# Altium schematic sheet STM32.SchDoc
size B; DocumentNumber: 3; SheetNumber: 2; SheetTotal: 4
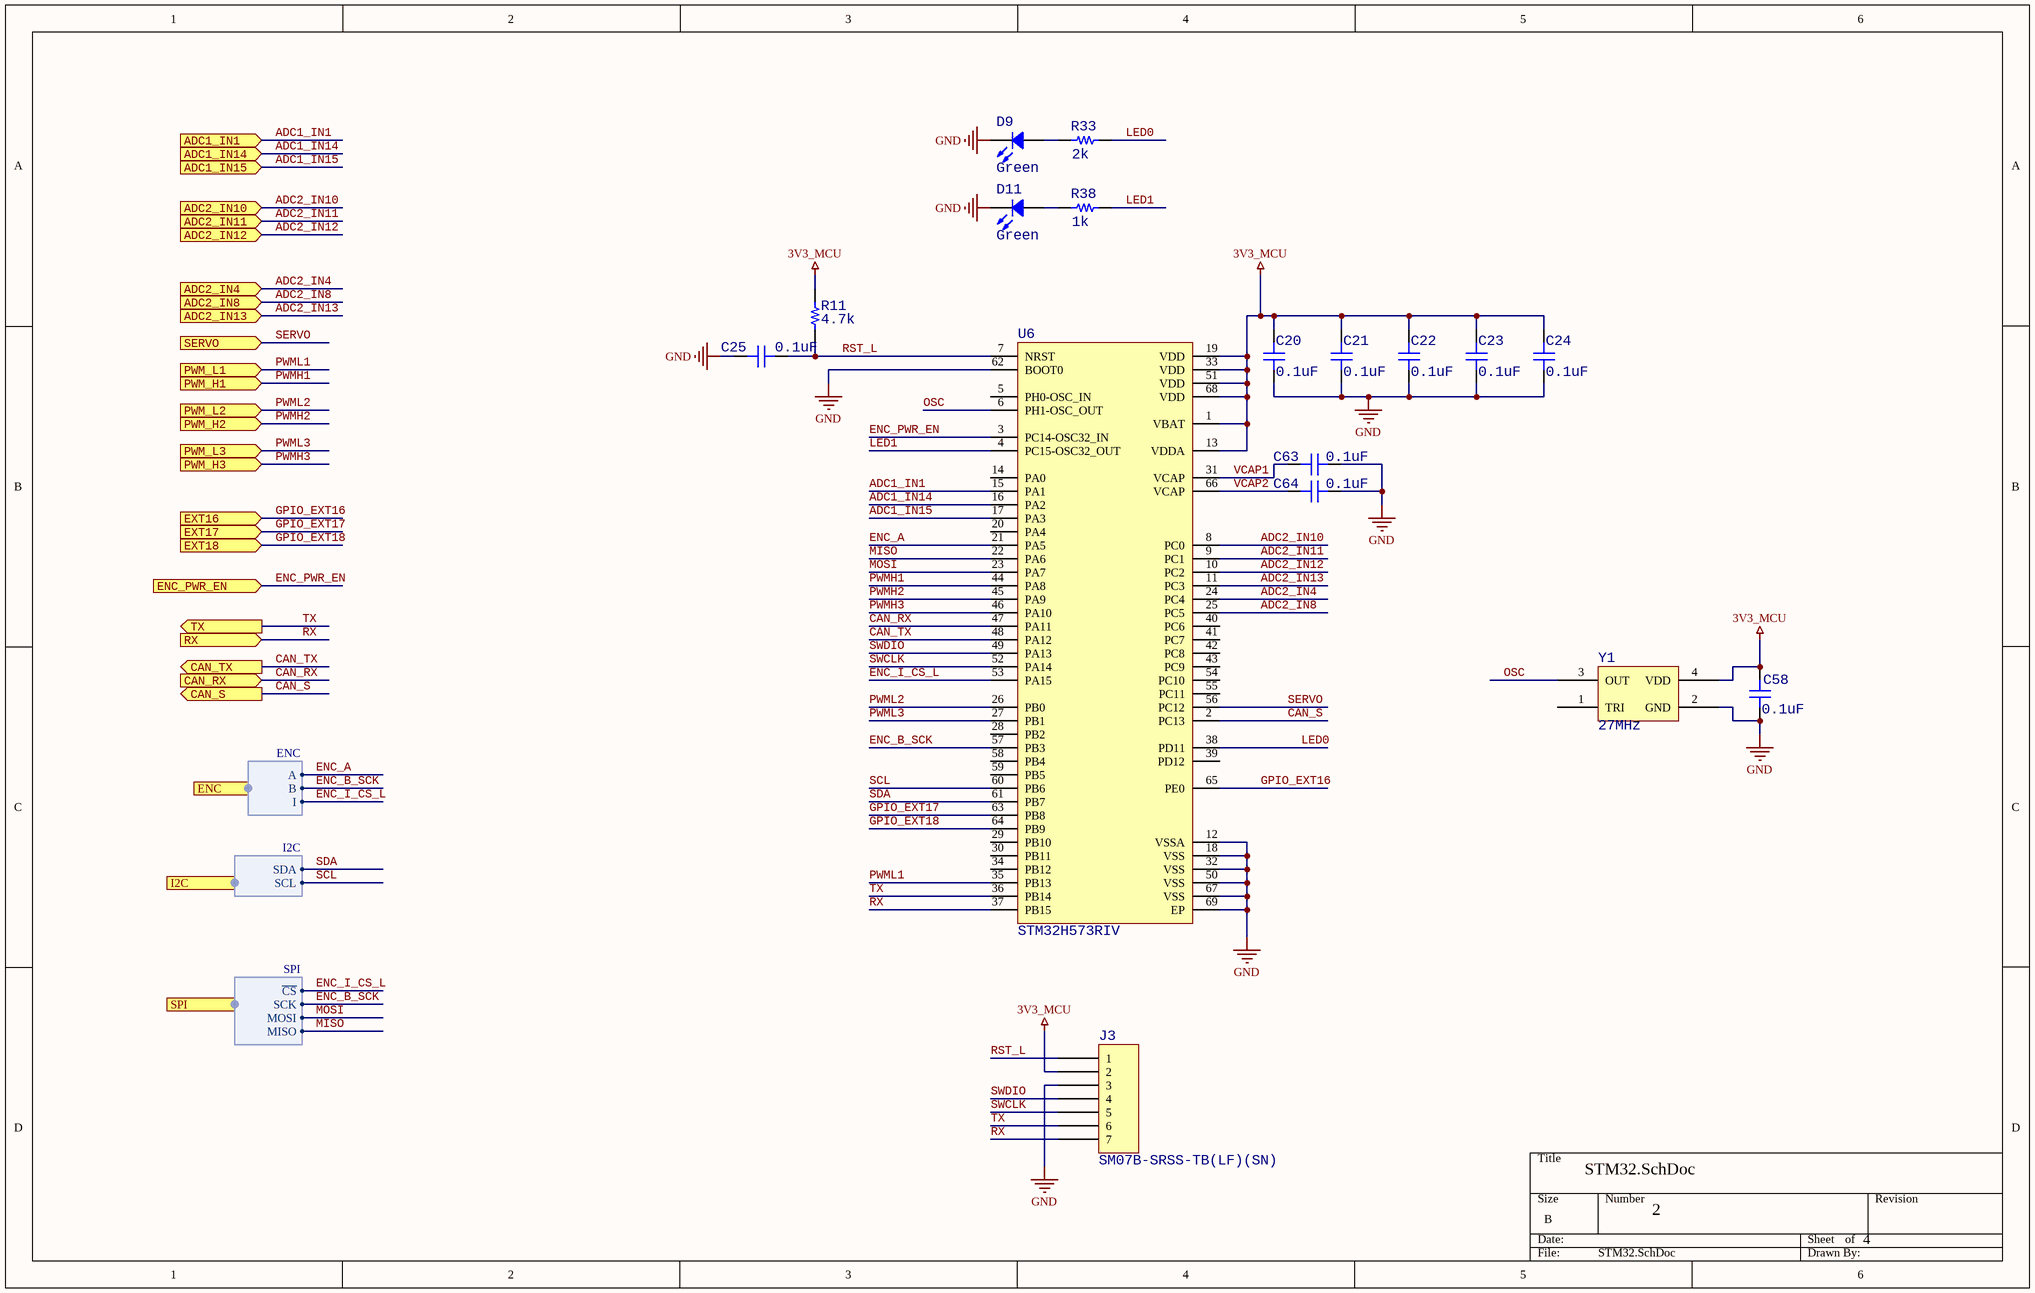
[diagram p0: STM32.SchDoc]

## Parts
C20  0.1uF  [CAP_0402]
C21  0.1uF  [CAP_0402]
C22  0.1uF  [CAP_0402]
C23  0.1uF  [CAP_0402]
C24  0.1uF  [CAP_0402]
C25  0.1uF  [CAP_0402]
C58  0.1uF  [CAP_0402]
C63  0.1uF  [CAP_0402]
C64  0.1uF  [CAP_0402]
D9  Green  [LED 0603_1608 GREEN]
D11  Green  [LED 0603_1608 GREEN]
J3  SM07B-SRSS-TB(LF)(SN)  [JST SM07B-SRSS-TB]
R11  4.7k  [RES_0402]
R33  2k  [RES_0402]
R38  1k  [RES_0402]
U6  STM32H573RIV  [68-VFQFPN]
Y1  27MHz  [ABRACON ASD]

## Ports
ADC1_IN1 (in), ADC1_IN14 (in), ADC1_IN15 (in), ADC2_IN4 (in), ADC2_IN8 (in), ADC2_IN10 (in), ADC2_IN11 (in), ADC2_IN12 (in), ADC2_IN13 (in), CAN_RX (in), CAN_S (out), CAN_TX (out), ENC (harness ENC), ENC_PWR_EN (in), EXT16 (in), EXT17 (in), EXT18 (in), I2C (harness I2C), PWM_H1 (in), PWM_H2 (in), PWM_H3 (in), PWM_L1 (in), PWM_L2 (in), PWM_L3 (in), RX (in), SERVO (in), SPI (harness SPI), TX (out)

## Harnesses
I2C: SDA, SCL
ENC: A, B, I
SPI: ~{CS}, SCK, MOSI, MISO

## Nets
3V3_MCU: C20.2 C21.2 C22.2 C23.2 C24.2 C58.2 J3.2 R11.2 U6.1(VBAT) U6.13(VDDA) U6.19(VDD) U6.33(VDD) U6.51(VDD) U6.68(VDD) Y1.4(VDD)
GND: C20.1 C21.1 C22.1 C23.1 C24.1 C25.2 C58.1 C63.1 C64.1 D9.2 D11.2 J3.3 U6.12(VSSA) U6.18(VSS) U6.32(VSS) U6.50(VSS) U6.62(BOOT0) U6.67(VSS) U6.69(EP) Y1.2(GND)
ADC1_IN1: U6.15(PA1) ; port ADC1_IN1
ADC1_IN14: U6.16(PA2) ; port ADC1_IN14
ADC1_IN15: U6.17(PA3) ; port ADC1_IN15
ADC2_IN4: U6.24(PC4) ; port ADC2_IN4
ADC2_IN8: U6.25(PC5) ; port ADC2_IN8
ADC2_IN10: U6.8(PC0) ; port ADC2_IN10
ADC2_IN11: U6.9(PC1) ; port ADC2_IN11
ADC2_IN12: U6.10(PC2) ; port ADC2_IN12
ADC2_IN13: U6.11(PC3) ; port ADC2_IN13
CAN_RX: U6.47(PA11) ; port CAN_RX
CAN_S: U6.2(PC13) ; port CAN_S
CAN_TX: U6.48(PA12) ; port CAN_TX
ENC_A: U6.21(PA5) ; port ENC.A
ENC_B_SCK: U6.57(PB3) ; port ENC.B, port SPI.SCK
ENC_I_CS_L: U6.53(PA15) ; port ENC.I, port SPI.~{CS}
ENC_PWR_EN: U6.3(PC14-OSC32_IN) ; port ENC_PWR_EN
GPIO_EXT16: U6.65(PE0) ; port EXT16
GPIO_EXT17: U6.63(PB8) ; port EXT17
GPIO_EXT18: U6.64(PB9) ; port EXT18
LED0: R33.2 U6.38(PD11)
LED1: R38.2 U6.4(PC15-OSC32_OUT)
MISO: U6.22(PA6) ; port SPI.MISO
MOSI: U6.23(PA7) ; port SPI.MOSI
OSC: U6.6(PH1-OSC_OUT) Y1.3(OUT)
PWMH1: U6.44(PA8) ; port PWM_H1
PWMH2: U6.45(PA9) ; port PWM_H2
PWMH3: U6.46(PA10) ; port PWM_H3
PWML1: U6.35(PB13) ; port PWM_L1
PWML2: U6.26(PB0) ; port PWM_L2
PWML3: U6.27(PB1) ; port PWM_L3
RST_L: C25.1 J3.1 R11.1 U6.7(NRST)
RX: J3.7 U6.37(PB15) ; port RX
SCL: U6.60(PB6) ; port I2C.SCL
SDA: U6.61(PB7) ; port I2C.SDA
SERVO: U6.56(PC12) ; port SERVO
SWCLK: J3.5 U6.52(PA14)
SWDIO: J3.4 U6.49(PA13)
TX: J3.6 U6.36(PB14) ; port TX
VCAP1: C63.2 U6.31(VCAP)
VCAP2: C64.2 U6.66(VCAP)
NetD9_1: D9.1 R33.1
NetD11_1: D11.1 R38.1

Not connected (* = marked no-connect by the designer): U6 5(PH0-OSC_IN) 14(PA0) 20(PA4) 28(PB2) 29(PB10) 30(PB11) 34(PB12) 39(PD12) 40(PC6) 41(PC7) 42(PC8) 43(PC9) 54(PC10) 55(PC11) 58(PB4) 59(PB5); Y1 1(TRI)

## Library data of the parts
C20-C25 C58 C63 C64 = CAP_0402: CAP CER 402; Value: 0.1uF
D9 D11 = XZCDGK53W-8VF: LED GREEN CLEAR 2SMD; Manufacturer: SunLED; Configuration: Independent; Current - Test: 2mA; Lens Color: Colorless; Lens Size: 0.35mm Dia; Lens Style: Round with Domed Top; Millicandela Rating: 417mcd; Viewing Angle: 60°; Voltage - Forward (Vf) (Typ): 2.65V; Wavelength - Dominant: 525nm; Wavelength - Peak: 515nm; Part Number: XZCDGK53W-8VF; Color: Green; ComponentLink1Description: Datasheet; ComponentLink1URL: https://www.sunledusa.com/products/spec/XZCDGK53W-8VF.pdf; ComponentLink2Description: DigiKey Link; ComponentLink2URL: https://www.digikey.com/en/products/detail/sunled/XZCDGK53W-8VF/10449775; Device Package: 0603 (1608 Metric); Height (Max): 1.10mm; LastUpdated: 6/3/2024 7:58:52 PM; Lens Transparency: Clear; Lifecycle Status: Active; Minimum Order: 1; Mounting Type: Surface Mount; Package / Case: 0603 (1608 Metric); Packaging: TapeAndReel; PartId: 938; Part Status: Active; Price: 0.15; Series: Ultra Low Current; Size / Dimension: 1.60mm L x 0.80mm W; Supplier 1: DigiKey; Supplier Part Number 1: 1497-XZCDGK53W-8VFCT-ND; Supplier Device Package: 2-SMD; Value: Green
J3 = SM07B-SRSS-TB(LF)(SN): CONN HEADER SMD R/A 7POS 1MM; Manufacturer: JST Sales America Inc.; Current Rating (Amps): 0.7A; Material Flammability Rating: UL94 V-0; Number of Positions: 7; Number of Positions Loaded: All; Pitch - Mating: 0.039" (1.00mm); Shrouding: Shrouded - 4 Wall; Style: Board to Cable/Wire; Voltage Rating: 50V; Part Number: SM07B-SRSS-TB(LF)(SN); ComponentLink1Description: Datasheet; ComponentLink1URL: http://www.jst-mfg.com/product/pdf/eng/eSH.pdf; ComponentLink2Description: DigiKey Link; ComponentLink2URL: http://digikey.com/product-detail/en/jst-sales-america-inc/SM07B-SRSS-TB-LF-SN/455-1807-1-ND/926878; Connector Type: Header; Contact Finish - Mating: Tin; Contact Finish - Post: Tin; Contact Material: Copper Alloy; Contact Shape: Square; Contact Type: Male Pin; Fastening Type: Push-Pull; Features: Solder Retention; Insulation Color: Natural; Insulation Height: 0.114" (2.90mm); Insulation Material: Polyamide (PA), Nylon; LastUpdated: 1/12/2020 11:42:26 PM; Lifecycle Status: Active; Minimum Order: 1; Mounting Type: Surface Mount, Right Angle; Number of Rows: 1; Operating Temperature: -25°C ~ 85°C; Packaging: TapeAndReel; PartId: 65; Part Status: Active; Price: 0.39; Series: SR; Supplier 1: DigiKey; Supplier Part Number 1: 455-1807-1-ND; Termination: Solder
R11 R33 R38 = RES_0402: RES 0402
Y1 = ASD3-27.000MHZ-EC-T: XTAL OSC XO 27.0000MHZ HCMOS SMD; Manufacturer: Abracon LLC; Base Resonator: Crystal; Current - Supply (Max): 4mA; Frequency Stability: ±50ppm; Function: Enable/Disable; Voltage - Supply: 1.8V; Part Number: ASD3-27.000MHZ-EC-T; ComponentLink1Description: Datasheet; ComponentLink1URL: https://abracon.com/Oscillators/ASDseries.pdf; ComponentLink2Description: DigiKey Link; ComponentLink2URL: http://digikey.com/product-detail/en/abracon-llc/ASD3-27.000MHZ-EC-T/535-9608-1-ND/1237075; Frequency: 27MHz; Height - Seated (Max): 0.039" (1.00mm); LastUpdated: 6/3/2024 8:02:05 PM; Lifecycle Status: Active; Minimum Order: 1; Mounting Type: Surface Mount; Operating Temperature: -20°C ~ 70°C; Output: HCMOS; Package / Case: 4-SMD, No Lead; Packaging: TapeAndReel; PartId: 4; Part Status: Active; Price: 1.74; Series: ASD; Size / Dimension: 0.098" L x 0.079" W (2.50mm x 2.00mm); Supplier 1: DigiKey; Supplier Part Number 1: 535-9608-1-ND; Type: XO (Standard); Value: 27MHz